# EAGLE schematic Alpha_Power_Board_v7 (EAGLE 9.6.2)

## Sheet 1 of 7
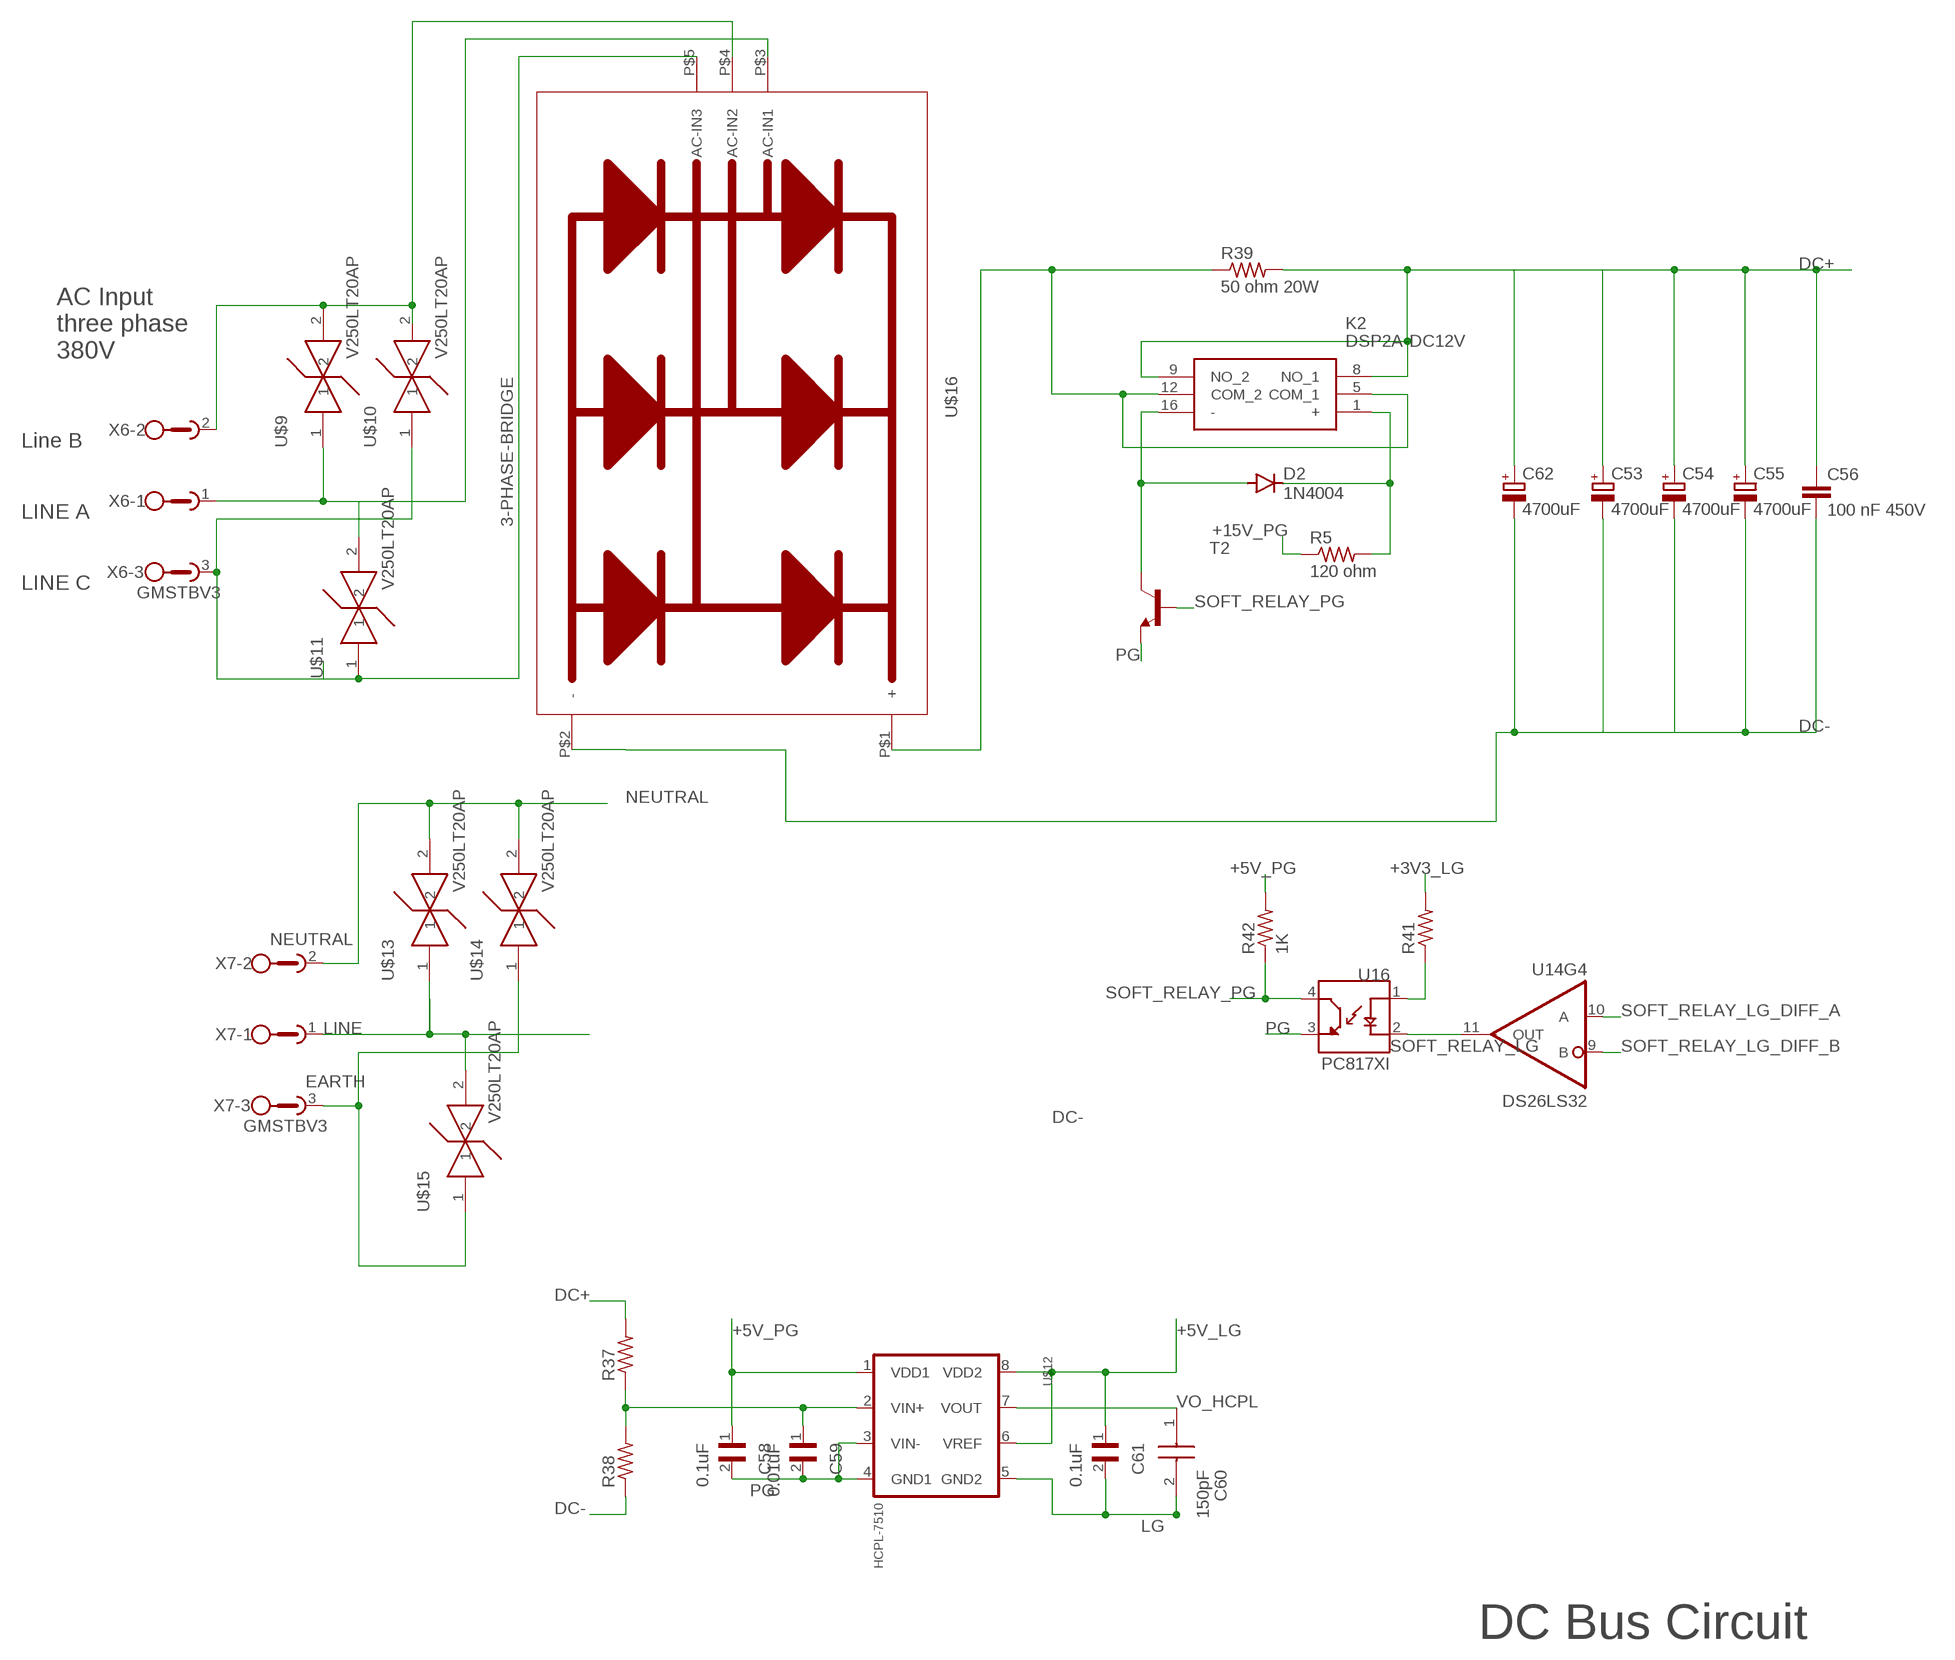
[diagram p0: schematic, sheet 1]

### Parts
C53  4700uF  CPOL-EUE10-35  [EB35D]
C54  4700uF  CPOL-EUE10-35  [EB35D]
C55  4700uF  CPOL-EUE10-35  [EB35D]
C56  100 nF 450V  C-EU102-064X133  [C102-064X133]
C58  0.1uF  C1206X104J3REC7210  [CAPC3316X140N]
C59  0.01uF  C1206X104J3REC7210  [CAPC3316X140N]
C60  150pF  CAP150PF  [CAP150PF]
C61  0.1uF  C1206X104J3REC7210  [CAPC3316X140N]
C62  4700uF  CPOL-EUE10-35  [EB35D]
D2  1N4004  [DO41-10]
K2  DSP2A-DC12V  [DSP2ADC12V]
R5  120 ohm  R-US_0207/15  [0207/15]
R37  R-US_0309/12  [0309/12]
R38  R-US_0309/12  [0309/12]
R39  50 ohm 20W  B20J50RE  [B20J50RE]
R41  R-US_R1206  [R1206]
R42  1K  R-US_R1206  [R1206]
T2  MMBT2222ALT1-NPN-SOT23-BEC  [SOT23-BEC]
U14  DS26LS32  [SOIC_16]
U16  PC817XI  [SOIC254P975X460-4N]
U$9  V250LT20AP  [V250LT20AP]
U$10  V250LT20AP  [V250LT20AP]
U$11  V250LT20AP  [V250LT20AP]
U$12  HCPL-7510  HCPL-7510U  [HCPL-7510]
U$13  V250LT20AP  [V250LT20AP]
U$14  V250LT20AP  [V250LT20AP]
U$15  V250LT20AP  [V250LT20AP]
U$16  3-PHASE-BRIDGE  [3-PHASE-BRIDGE]
X6  GMSTBV3  [GMSTBV3]
X7  GMSTBV3  [GMSTBV3]

### Nets
+3V3_LG: R41.2 ; also sheet 2,3,4,5
+5V_LG: C61.1 U$12.6(VREF) U$12.8(VDD2) ; also sheet 2,3,5
+5V_PG: C58.1 R42.2 U$12.1(VDD1) ; also sheet 2,3
+15V_PG: R5.1 ; also sheet 2,3
DC+: C53.+ C54.+ C55.+ C56.1 C62.+ K2.8(NO_1) K2.9(NO_2) R37.2 R39.2 ; also sheet 3
DC-: C53.- C54.- C55.- C56.2 C62.- R38.1 U$16.P$2(-) ; also sheet 3
EARTH: U$14.1 U$15.1 X7.3
L1: U$9.1 U$11.2 U$16.P$3(AC-IN1) X6.1
L2: U$9.2 U$10.2 U$16.P$4(AC-IN2) X6.2
L3: U$10.1 U$11.1 U$16.P$5(AC-IN3) X6.3
LG: C60.2 C61.2 U$12.5(GND2) ; also sheet 2,3,4,5,6,7
LINE: U$13.1 U$15.2 X7.1 ; also sheet 2
N$1: C59.1 R37.1 R38.2 U$12.2(VIN+)
N$2: D2.C K2.1(+) R5.2
N$3: D2.A K2.16(-) T2.C
N$4: R41.1 U16.1(A)
N$20 [New Class]: K2.5(COM_1) K2.12(COM_2) R39.1 U$16.P$1(+)
NEUTRAL: U$13.2 U$14.2 X7.2 ; also sheet 2
PG: C58.2 C59.2 T2.E U16.3(ET) U$12.3(VIN-) U$12.4(GND1) ; also sheet 2,3
SOFT_RELAY_LG: U14.11(OUT) U16.2(C)
SOFT_RELAY_LG_DIFF_A: U14.10(A) ; also sheet 7
SOFT_RELAY_LG_DIFF_B: U14.9(B) ; also sheet 7
SOFT_RELAY_PG: R42.1 T2.B U16.4(CT)
VO_HCPL: C60.1 U$12.7(VOUT) ; also sheet 4
Unconnected: U14.1(B) U14.2(A) U14.3(OUT) U14.4(EN) U14.5(OUT) U14.6(A) U14.7(B) U14.8(GND) U14.12(!EN) U14.13(OUT) U14.14(A) U14.15(B) U14.16(VCC)

### Notes on the sheet
- AC Input
  three phase 
  380V
- Line B
- LINE A
- LINE C
- DC Bus Circuit

## Sheet 2 of 7
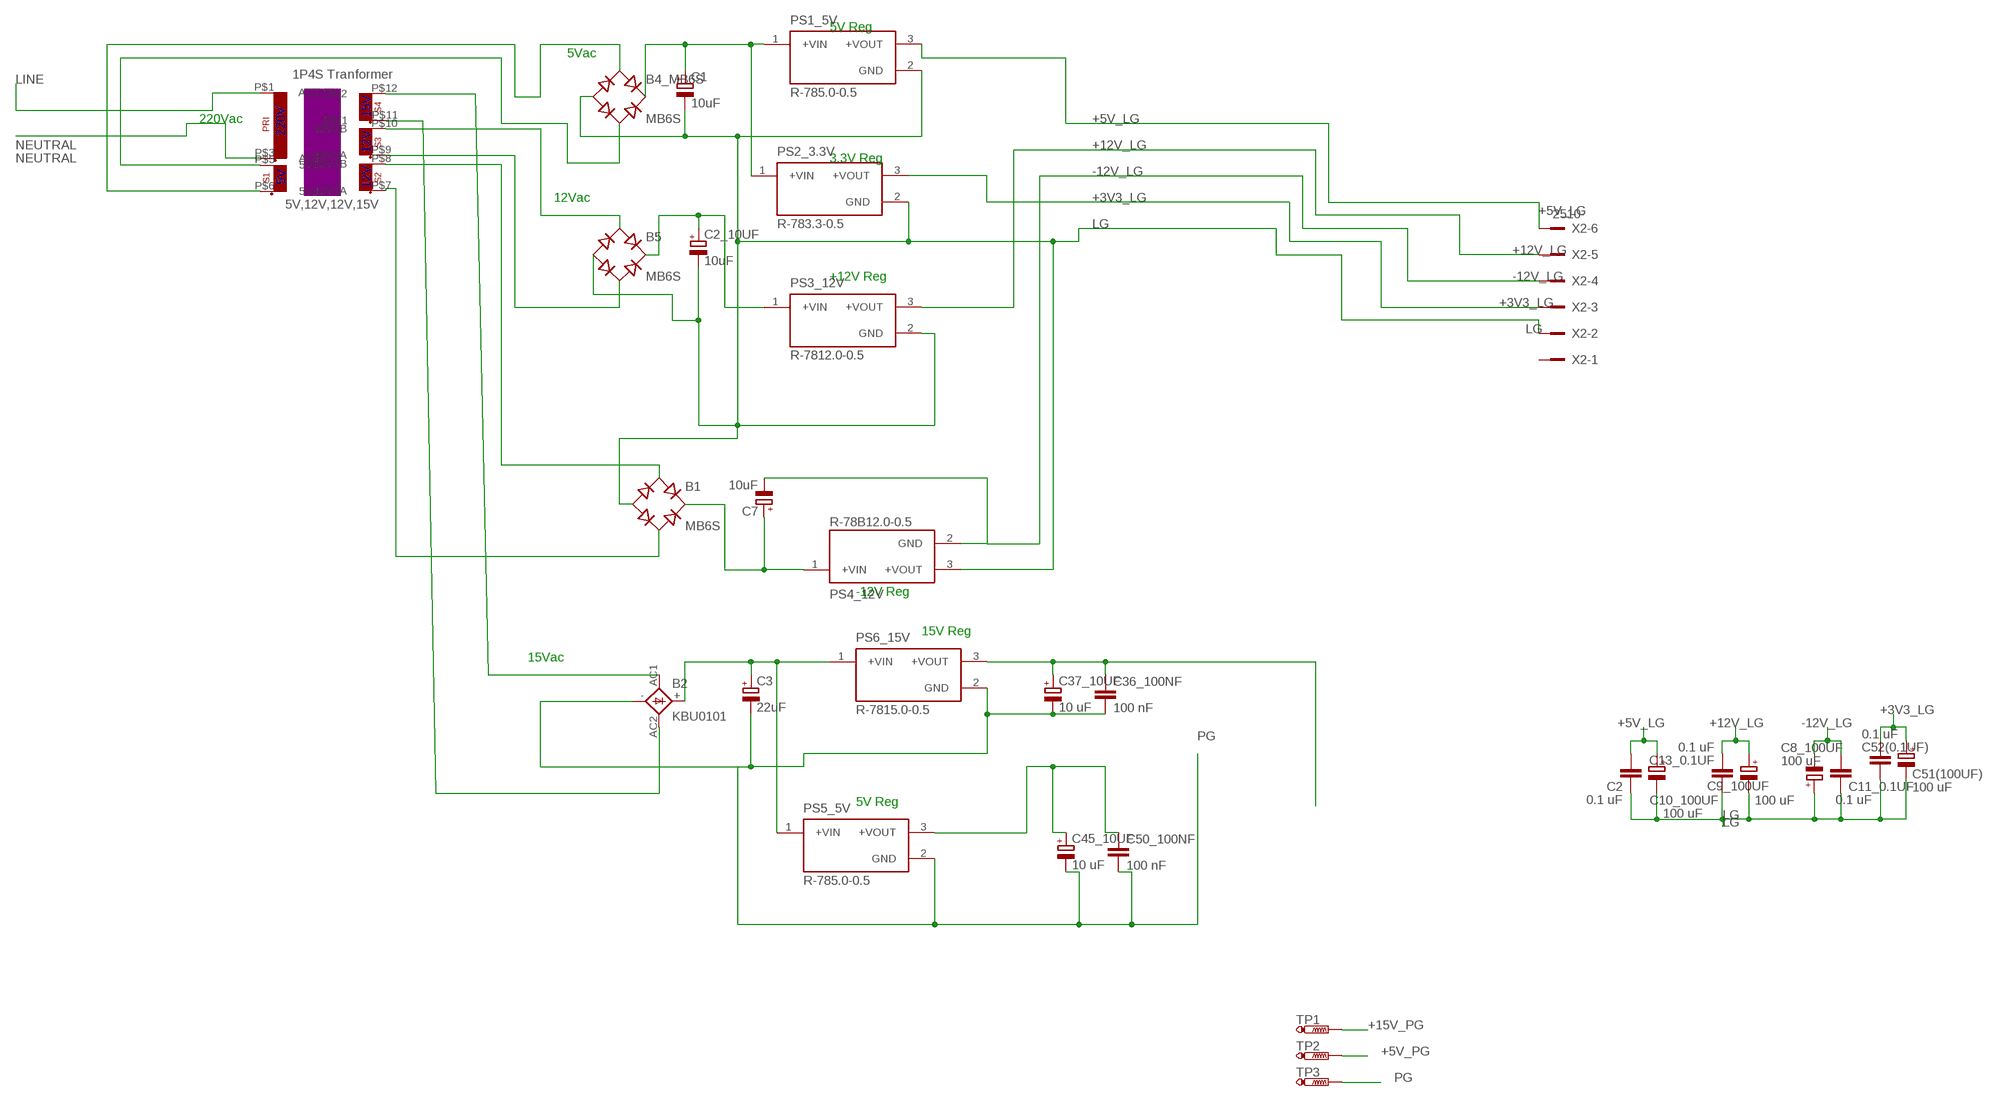
[diagram p1: schematic, sheet 2]

### Parts
B1  MB6S  [SOIC-4]
B2  KBU0101  KBU  [KBU]
B4_MB6S  MB6S  [SOIC-4]
B5  MB6S  [SOIC-4]
C1  10uF  CPOL-EUE2,5-6E  [E2,5-6E]
C2  0.1 uF  C-EUC1206  [C1206]
C2_10UF  10uF  CPOL-EUE2,5-6E  [E2,5-6E]
C3  22uF  CPOL-EUE2,5-6E  [E2,5-6E]
C7  10uF  CPOL-EUE2,5-6E  [E2,5-6E]
C8_100UF  100 uF  CPOL-EU153CLV-0605  [153CLV-0605]
C9_100UF  100 uF  CPOL-EU153CLV-0605  [153CLV-0605]
C10_100UF  100 uF  CPOL-EU153CLV-0605  [153CLV-0605]
C11_0.1UF  0.1 uF  C-EUC1206  [C1206]
C13_0.1UF  0.1 uF  C-EUC1206  [C1206]
C36_100NF  100 nF  C-EU025-025X050  [C025-025X050]
C37_10UF  10 uF  CPOL-EUTT2D5  [TT2D5]
C45_10UF  10 uF  CPOL-EUTT2D5  [TT2D5]
C50_100NF  100 nF  C-EU025-025X050  [C025-025X050]
C51(100UF)  100 uF  CPOL-EU153CLV-0605  [153CLV-0605]
C52(0.1UF)  0.1 uF  C-EUC1206  [C1206]
PS1_5V  R-785.0-0.5  R-78E5.0-0.5  [CONV_R-78E5.0-0.5]
PS2_3.3V  R-783.3-0.5  R-78E5.0-0.5  [CONV_R-78E5.0-0.5]
PS3_12V  R-7812.0-0.5  R-78E5.0-0.5  [CONV_R-78E5.0-0.5]
PS4_12V  R-78B12.0-0.5  R-78E5.0-0.5  [CONV_R-78E5.0-0.5]
PS5_5V  R-785.0-0.5  R-78E5.0-0.5  [CONV_R-78E5.0-0.5]
PS6_15V  R-7815.0-0.5  R-78E5.0-0.5  [CONV_R-78E5.0-0.5]
TP1  PTR1PAD1-13  [P1-13]
TP2  PTR1PAD1-13  [P1-13]
TP3  PTR1PAD1-13  [P1-13]
U$1  TRANSFORMERTHROUGH-HOLE  [T1P2S]
X2  2510-  [PAK100/2500-10]

### Nets
+3V3_LG: C51(100UF).+ C52(0.1UF).1 PS2_3.3V.3(+VOUT) X2.3 ; also sheet 1,3,4,5
+5V_LG: C2.1 C10_100UF.+ PS1_5V.3(+VOUT) X2.6 ; also sheet 1,3,5
+5V_PG: C45_10UF.+ C50_100NF.1 PS5_5V.3(+VOUT) TP2.TP ; also sheet 1,3
+12V_LG: C9_100UF.+ C13_0.1UF.1 PS3_12V.3(+VOUT) X2.5 ; also sheet 4,6
+15V_PG: C36_100NF.1 C37_10UF.+ PS6_15V.3(+VOUT) TP1.TP ; also sheet 1,3
-12V_LG: C7.- C8_100UF.- C11_0.1UF.1 PS4_12V.2(GND) X2.4 ; also sheet 4
LG: B1.- B4_MB6S.- B5.- C1.- C2.2 C2_10UF.- C8_100UF.+ C9_100UF.- C10_100UF.- C11_0.1UF.2 C13_0.1UF.2 C51(100UF).- C52(0.1UF).2 PS1_5V.2(GND) PS2_3.3V.2(GND) PS3_12V.2(GND) PS4_12V.3(+VOUT) X2.2 ; also sheet 1,3,4,5,6,7
LINE: U$1.P$1(AC1) ; also sheet 1
N$6: B4_MB6S.~2(AC2) U$1.P$5(5V1)
N$9: B5.~1(AC1) U$1.P$10(12V2B)
N$15: B5.~2(AC2) U$1.P$9(12V2A)
N$17: B5.+ C2_10UF.+ PS3_12V.1(+VIN)
N$18: B2.AC1 U$1.P$12(15V2)
N$19: B2.AC2 U$1.P$11(15V1)
N$24: B4_MB6S.~1(AC1) U$1.P$6(5V2)
N$25: B1.~1(AC1) U$1.P$8(12V1B)
N$26: B1.~2(AC2) U$1.P$7(12V1A)
N$27: B1.+ C7.+ PS4_12V.1(+VIN)
N$28: B2.+ C3.+ PS5_5V.1(+VIN) PS6_15V.1(+VIN)
N$29: B4_MB6S.+ C1.+ PS1_5V.1(+VIN) PS2_3.3V.1(+VIN)
NEUTRAL: U$1.P$3(AC2) ; also sheet 1
PG: B2.- C3.- C36_100NF.2 C37_10UF.- C45_10UF.- C50_100NF.2 PS5_5V.2(GND) PS6_15V.2(GND) TP3.TP ; also sheet 1,3
Unconnected: X2.1 X2.7 X2.8 X2.9 X2.10

### Notes on the sheet
- 5V Reg
- 5Vac
- 220Vac
- 3.3V Reg
- 12Vac
- +12V Reg
- -12V Reg
- 15V Reg
- 15Vac
- 5V Reg

## Sheet 3 of 7
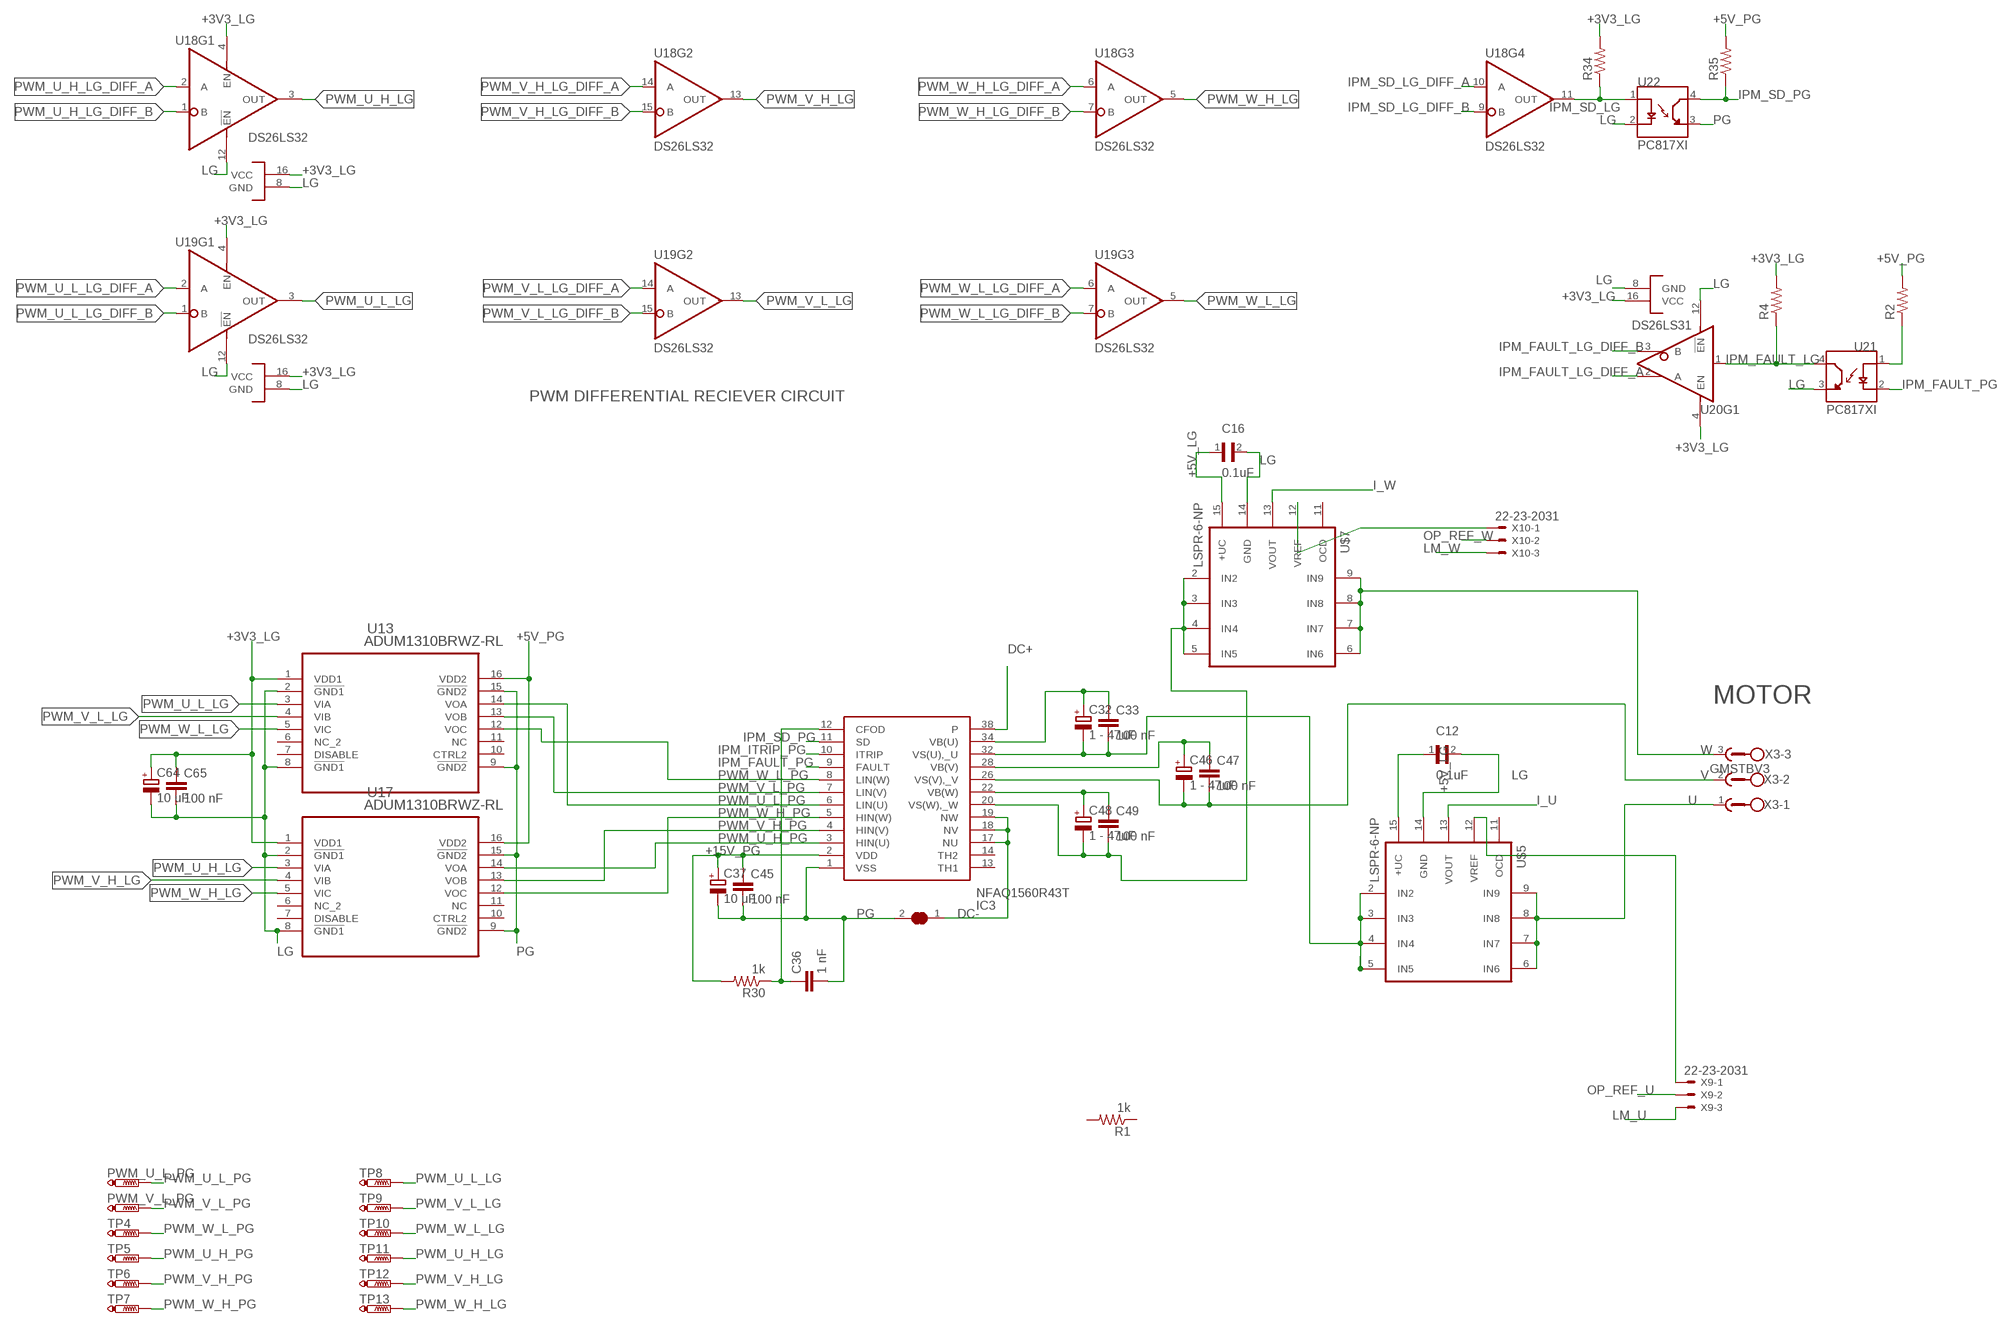
[diagram p2: schematic, sheet 3]

### Parts
C12  0.1uF  C1206X104J3REC7210  [CAPC3316X140N]
C16  0.1uF  C1206X104J3REC7210  [CAPC3316X140N]
C32  1 - 47uF  CPOL-EUE3.5-8  [E3,5-8]
C33  100 nF  C-EU025-030X050  [C025-030X050]
C36  1 nF  C-EU025-025X050  [C025-025X050]
C37  10 uF  CPOL-EUTT2D5  [TT2D5]
C45  100 nF  C-EU025-025X050  [C025-025X050]
C46  1 - 47uF  CPOL-EUE3.5-8  [E3,5-8]
C47  100 nF  C-EU025-030X050  [C025-030X050]
C48  1 - 47uF  CPOL-EUE3.5-8  [E3,5-8]
C49  100 nF  C-EU025-030X050  [C025-030X050]
C64  10 uF  CPOL-EUSMCP  [SMC_P]
C65  100 nF  C-EUC1206  [C1206]
IC3  NFAQ1560R43T  [NFAQ1560R43T]
PWM_U_L_PG  PTR1PAD1-13  [P1-13]
PWM_V_L_PG  PTR1PAD1-13  [P1-13]
R1  1k  R-US_0204/2V  [0204V]
R2  R-US_R1206  [R1206]
R4  R-US_R1206  [R1206]
R30  1k  R-US_0204/2V  [0204V]
R34  R-US_R0805W  [R0805W]
R35  R-US_R0805  [R0805]
TP4  PTR1PAD1-13  [P1-13]
TP5  PTR1PAD1-13  [P1-13]
TP6  PTR1PAD1-13  [P1-13]
TP7  PTR1PAD1-13  [P1-13]
TP8  PTR1PAD1-13  [P1-13]
TP9  PTR1PAD1-13  [P1-13]
TP10  PTR1PAD1-13  [P1-13]
TP11  PTR1PAD1-13  [P1-13]
TP12  PTR1PAD1-13  [P1-13]
TP13  PTR1PAD1-13  [P1-13]
U13  ADUM1310BRWZ-RL  [RW_16_ADI]
U17  ADUM1310BRWZ-RL  [RW_16_ADI]
U18  DS26LS32  [SOIC_16]
U19  DS26LS32  [SOIC_16]
U20  DS26LS31  [SOIC_16]
U21  PC817XI  [SOIC254P975X460-4N]
U22  PC817XI  [SOIC254P975X460-4N]
U$2  GND_CONNECT  [GND_CONNECT]
U$5  LSPR-6-NP  [LPSR-15-NP]
U$7  LSPR-6-NP  [LPSR-15-NP]
X3  GMSTBV3  [GMSTBV3]
X9  22-23-2031  [22-23-2031]
X10  22-23-2031  [22-23-2031]

### Nets
+3V3_LG: C64.+ C65.1 R4.2 R34.2 U13.1(VDD1) U17.1(VDD1) U18.4(EN) U18.16(VCC) U19.4(EN) U19.16(VCC) U20.4(EN) U20.16(VCC) ; also sheet 1,2,4,5
+5V_LG: C12.1 C16.1 U$5.15(+UC) U$7.15(+UC) ; also sheet 1,2,5
+5V_PG: R2.2 R35.2 U13.16(VDD2) U17.16(VDD2) ; also sheet 1,2
+15V_PG: C37.+ C45.1 IC3.2(VDD) R30.2 ; also sheet 1,2
DC+: IC3.38(P) ; also sheet 1
DC-: IC3.17(NU) IC3.18(NV) IC3.19(NW) U$2.1 ; also sheet 1
I_U: U$5.13(VOUT) ; also sheet 4
I_W: U$7.13(VOUT) ; also sheet 4
IPM_FAULT_LG: R4.1 U20.1(IN) U21.4(CT)
IPM_FAULT_LG_DIFF_A: U20.2(A) ; also sheet 7
IPM_FAULT_LG_DIFF_B: U20.3(B) ; also sheet 7
IPM_FAULT_PG: IC3.9(FAULT) U21.2(C)
IPM_ITRIP_PG: IC3.10(ITRIP)
IPM_SD_LG: R34.1 U18.11(OUT) U22.1(A)
IPM_SD_LG_DIFF_A: U18.10(A) ; also sheet 7
IPM_SD_LG_DIFF_B: U18.9(B) ; also sheet 7
IPM_SD_PG: IC3.11(SD) R35.1 U22.4(CT)
LG: C12.2 C16.2 C64.- C65.2 U13.2(!GND1) U13.8(!GND1) U17.2(!GND1) U17.8(!GND1) U18.8(GND) U18.12(!EN) U19.8(GND) U19.12(!EN) U20.8(GND) U20.12(!EN) U21.3(ET) U22.2(C) U$5.14(GND) U$7.14(GND) ; also sheet 1,2,4,5,6,7
LM_U: X9.3 ; also sheet 4
LM_W: X10.3 ; also sheet 4
N$14: R2.1 U21.1(A)
N$23: U$5.12(VREF) X9.1
N$30: C32.- C33.2 IC3.32(VS(U),_U) U$5.2(IN2) U$5.3(IN3) U$5.4(IN4) U$5.5(IN5)
N$33: U$7.12(VREF) X10.1
N$49: C32.+ C33.1 IC3.34(VB(U))
N$50: C48.+ C49.1 IC3.22(VB(W))
N$51: C48.- C49.2 IC3.20(VS(W),_W) U$7.2(IN2) U$7.3(IN3) U$7.4(IN4) U$7.5(IN5)
N$52: C46.+ C47.1 IC3.28(VB(V))
N$54: C36.1 IC3.12(CFOD) R30.1
OP_REF_U: X9.2 ; also sheet 4
OP_REF_W: X10.2 ; also sheet 4
PG: C36.2 C37.- C45.2 IC3.1(VSS) U13.9(!GND2) U13.15(!GND2) U17.9(!GND2) U17.15(!GND2) U22.3(ET) U$2.2 ; also sheet 1,2
PWM_U_H_LG: TP11.TP U17.3(VIA) U18.3(OUT)
PWM_U_H_LG_DIFF_A: U18.2(A) ; also sheet 7
PWM_U_H_LG_DIFF_B: U18.1(B) ; also sheet 7
PWM_U_H_PG: IC3.3(HIN(U)) TP5.TP U17.14(VOA)
PWM_U_L_LG: TP8.TP U13.3(VIA) U19.3(OUT)
PWM_U_L_LG_DIFF_A: U19.2(A) ; also sheet 7
PWM_U_L_LG_DIFF_B: U19.1(B) ; also sheet 7
PWM_U_L_PG: IC3.6(LIN(U)) PWM_U_L_PG.TP U13.14(VOA)
PWM_V_H_LG: TP12.TP U17.4(VIB) U18.13(OUT)
PWM_V_H_LG_DIFF_A: U18.14(A) ; also sheet 7
PWM_V_H_LG_DIFF_B: U18.15(B) ; also sheet 7
PWM_V_H_PG: IC3.4(HIN(V)) TP6.TP U17.13(VOB)
PWM_V_L_LG: TP9.TP U13.4(VIB) U19.13(OUT)
PWM_V_L_LG_DIFF_A: U19.14(A) ; also sheet 7
PWM_V_L_LG_DIFF_B: U19.15(B) ; also sheet 7
PWM_V_L_PG: IC3.7(LIN(V)) PWM_V_L_PG.TP U13.13(VOB)
PWM_W_H_LG: TP13.TP U17.5(VIC) U18.5(OUT)
PWM_W_H_LG_DIFF_A: U18.6(A) ; also sheet 7
PWM_W_H_LG_DIFF_B: U18.7(B) ; also sheet 7
PWM_W_H_PG: IC3.5(HIN(W)) TP7.TP U17.12(VOC)
PWM_W_L_LG: TP10.TP U13.5(VIC) U19.5(OUT)
PWM_W_L_LG_DIFF_A: U19.6(A) ; also sheet 7
PWM_W_L_LG_DIFF_B: U19.7(B) ; also sheet 7
PWM_W_L_PG: IC3.8(LIN(W)) TP4.TP U13.12(VOC)
U: U$5.6(IN6) U$5.7(IN7) U$5.8(IN8) U$5.9(IN9) X3.1
V: C46.- C47.2 IC3.26(VS(V),_V) X3.2
W: U$7.6(IN6) U$7.7(IN7) U$7.8(IN8) U$7.9(IN9) X3.3
Unconnected: IC3.13(TH1) IC3.14(TH2) R1.1 R1.2 U13.6(NC_2) U13.7(DISABLE) U13.10(CTRL2) U13.11(NC) U17.6(NC_2) U17.7(DISABLE) U17.10(CTRL2) U17.11(NC) U19.9(B) U19.10(A) U19.11(OUT) U20.5(B) U20.6(A) U20.7(IN) U20.9(IN) U20.10(A) U20.11(B) U20.13(B) U20.14(A) U20.15(IN) U$5.11(OCD) U$7.11(OCD)

### Notes on the sheet
- PWM DIFFERENTIAL RECIEVER CIRCUIT
- MOTOR

## Sheet 4 of 7
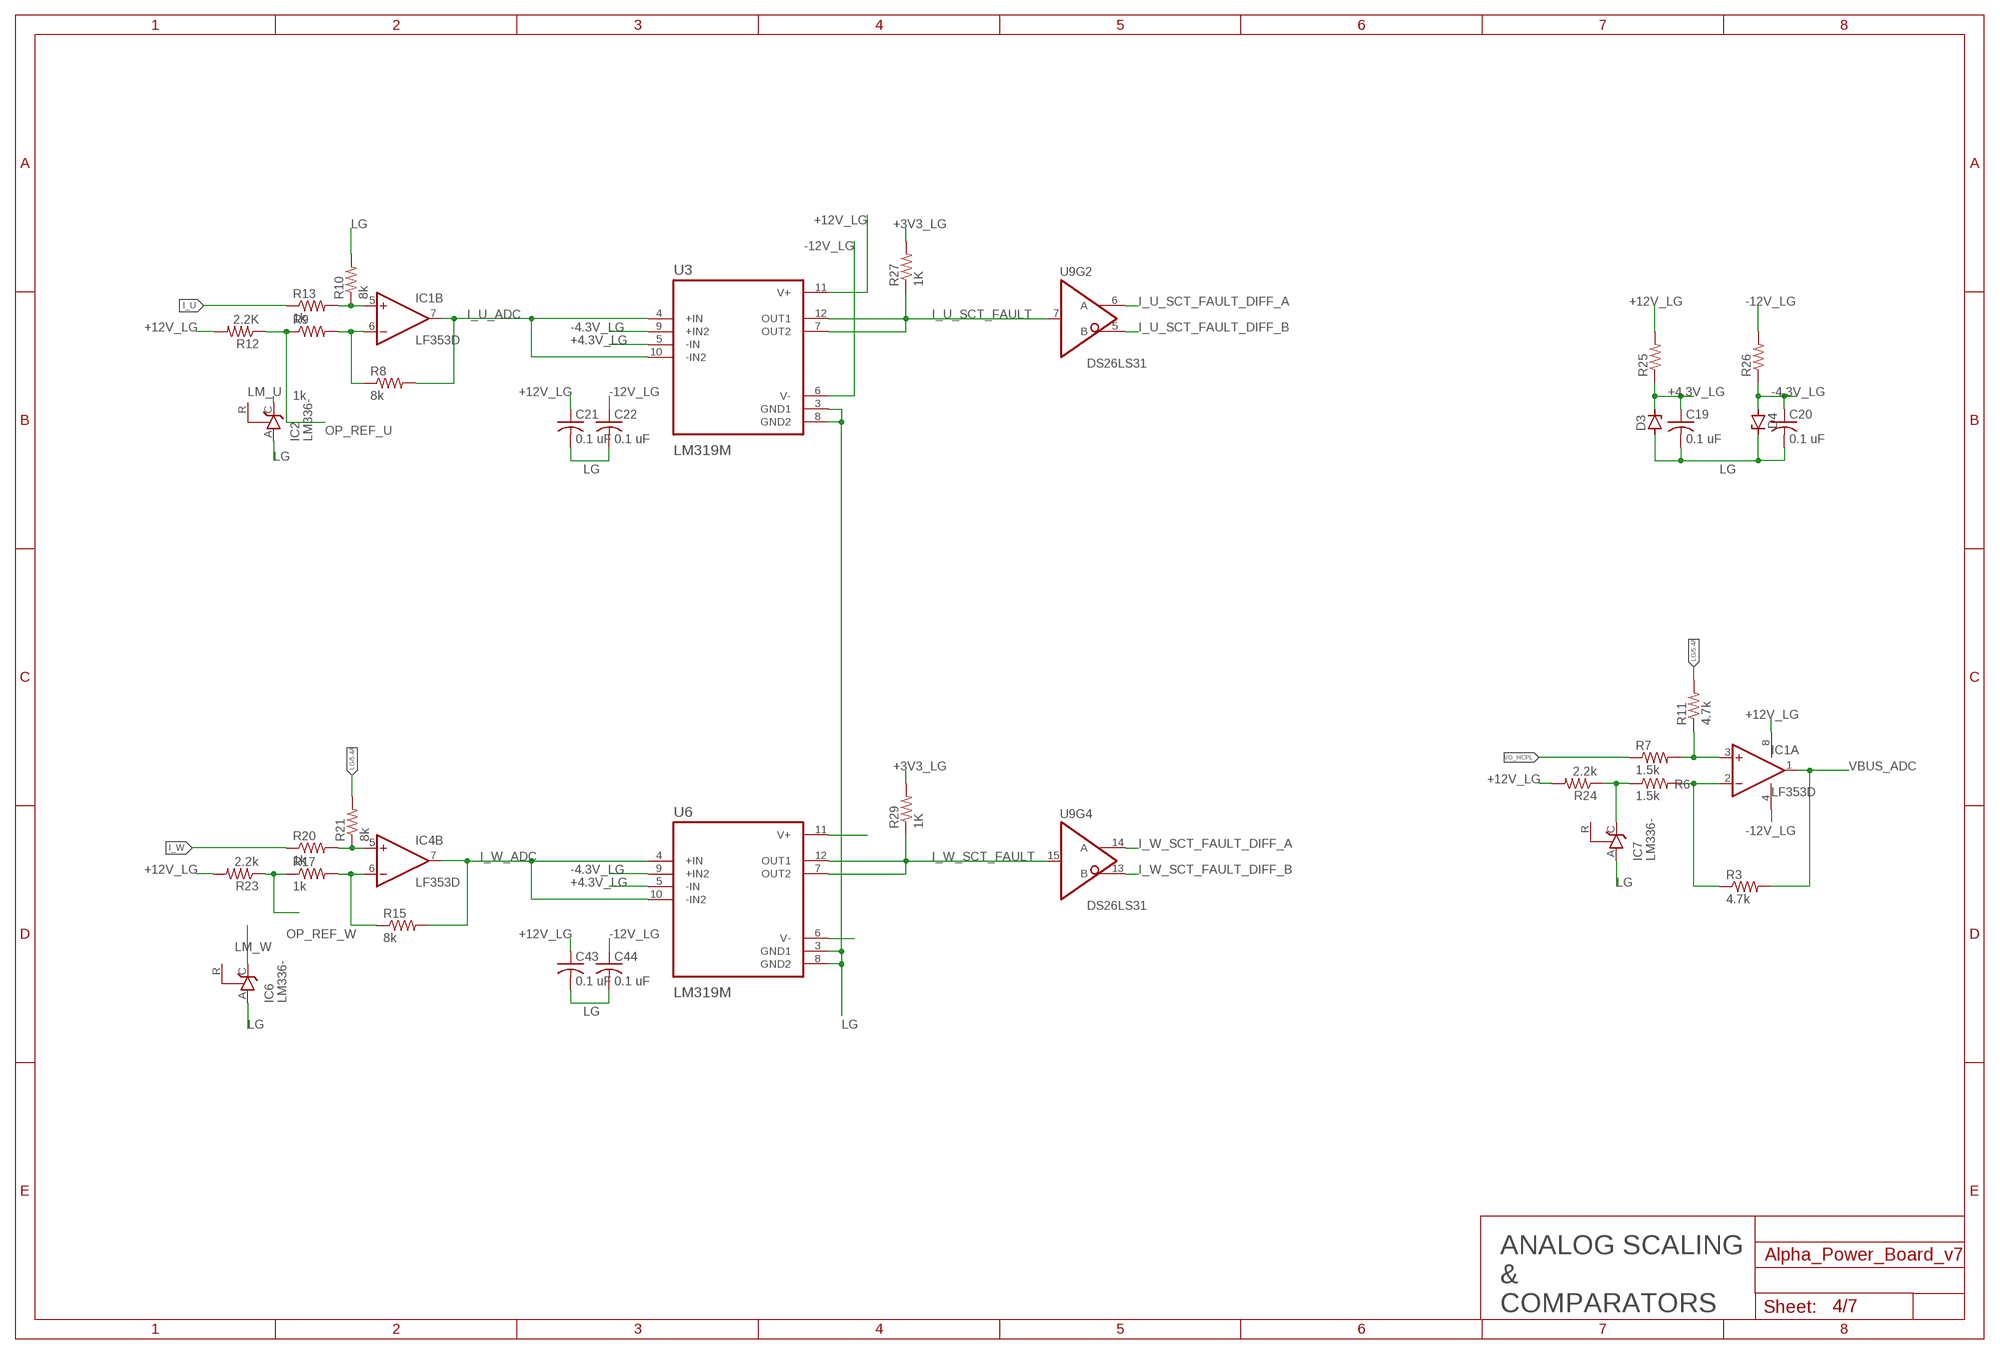
[diagram p3: schematic, sheet 4]

### Parts
C19  0.1 uF  C-USC1206  [C1206]
C20  0.1 uF  C-USC1206  [C1206]
C21  0.1 uF  C-USC1206  [C1206]
C22  0.1 uF  C-USC1206  [C1206]
C43  0.1 uF  C-USC1206  [C1206]
C44  0.1 uF  C-USC1206  [C1206]
D3  ZENER-DIODETO236  [TO236]
D4  ZENER-DIODETO236  [TO236]
IC1  LF353D  [SO08]
IC2  LM336-  [TO92A_VREF]
IC4  LF353D  [SO08]
IC6  LM336-  [TO92A_VREF]
IC7  LM336-  [TO92A_VREF]
R3  4.7k  R-US_M1206  [M1206]
R6  1.5k  R-US_M1206  [M1206]
R7  1.5k  R-US_R1206  [R1206]
R8  8k  R-US_M1206  [M1206]
R9  1k  R-US_M1206  [M1206]
R10  8k  R-US_M1206  [M1206]
R11  4.7k  R-US_M1206  [M1206]
R12  2.2K  R-US_M1206  [M1206]
R13  1k  R-US_M1206  [M1206]
R15  8k  R-US_M1206  [M1206]
R17  1k  R-US_M1206  [M1206]
R20  1k  R-US_M1206  [M1206]
R21  8k  R-US_M1206  [M1206]
R23  2.2k  R-US_M1206  [M1206]
R24  2.2k  R-US_M1206  [M1206]
R25  R-US_M1206  [M1206]
R26  R-US_M1206  [M1206]
R27  1K  R-US_R1206  [R1206]
R29  1K  R-US_R1206  [R1206]
U3  LM319M  [SOIC127P600X175-14N]
U6  LM319M  [SOIC127P600X175-14N]
U9  DS26LS31  [SOIC_16]

### Nets
+3V3_LG: R27.2 R29.2 ; also sheet 1,2,3,5
+4.3V_LG: C19.1 D3.C R25.1 U3.5(-IN) U6.5(-IN)
+12V_LG: C21.1 C43.1 IC1.8(P:V+) R12.2 R23.2 R24.2 R25.2 U3.11(V+) ; also sheet 2,6
-4.3V_LG: C20.1 D4.A R26.1 U3.9(+IN2) U6.9(+IN2)
-12V_LG: C22.1 C44.1 IC1.4(P:V-) R26.2 U3.6(V-) ; also sheet 2
I_U: R13.1 ; also sheet 3
I_U_ADC: IC1.7(B:OUT) R8.2 U3.4(+IN) U3.10(-IN2) ; also sheet 5
I_U_SCT_FAULT: R27.1 U3.7(OUT2) U3.12(OUT1) U9.7(IN)
I_U_SCT_FAULT_DIFF_A: U9.6(A) ; also sheet 7
I_U_SCT_FAULT_DIFF_B: U9.5(B) ; also sheet 7
I_W: R20.1 ; also sheet 3
I_W_ADC: IC4.7(B:OUT) R15.2 U6.4(+IN) U6.10(-IN2) ; also sheet 5
I_W_SCT_FAULT: R29.1 U6.7(OUT2) U6.12(OUT1) U9.15(IN)
I_W_SCT_FAULT_DIFF_A: U9.14(A) ; also sheet 7
I_W_SCT_FAULT_DIFF_B: U9.13(B) ; also sheet 7
LG: C19.2 C20.2 C21.2 C22.2 C43.2 C44.2 D3.A D4.C IC2.A IC6.A IC7.A R10.2 R11.2 R21.2 U3.3(GND1) U3.8(GND2) U6.3(GND1) U6.8(GND2) ; also sheet 1,2,3,5,6,7
LM_U: IC2.C ; also sheet 3
LM_W: IC6.C ; also sheet 3
N$7: IC1.6(B:-IN) R8.1 R9.2
N$8: IC1.3(A:+IN) R7.2 R11.1
N$11: IC4.6(B:-IN) R15.1 R17.2
N$12: IC1.2(A:-IN) R3.1 R6.2
N$13: U6.6(V-)
N$16: U6.11(V+)
N$34: IC1.5(B:+IN) R10.1 R13.2
N$38: IC4.5(B:+IN) R20.2 R21.1
N$43: IC7.C R6.1 R24.1
OP_REF_U: R9.1 R12.1 ; also sheet 3
OP_REF_W: R17.1 R23.1 ; also sheet 3
VBUS_ADC: IC1.1(A:OUT) R3.2 ; also sheet 5
VO_HCPL: R7.1 ; also sheet 1
Unconnected: IC2.R IC4.1(A:OUT) IC4.2(A:-IN) IC4.3(A:+IN) IC6.R IC7.R U9.1(IN) U9.2(A) U9.3(B) U9.4(EN) U9.8(GND) U9.9(IN) U9.10(A) U9.11(B) U9.12(!EN) U9.16(VCC)

### Notes on the sheet
- ANALOG SCALING
  & 
  COMPARATORS

## Sheet 5 of 7
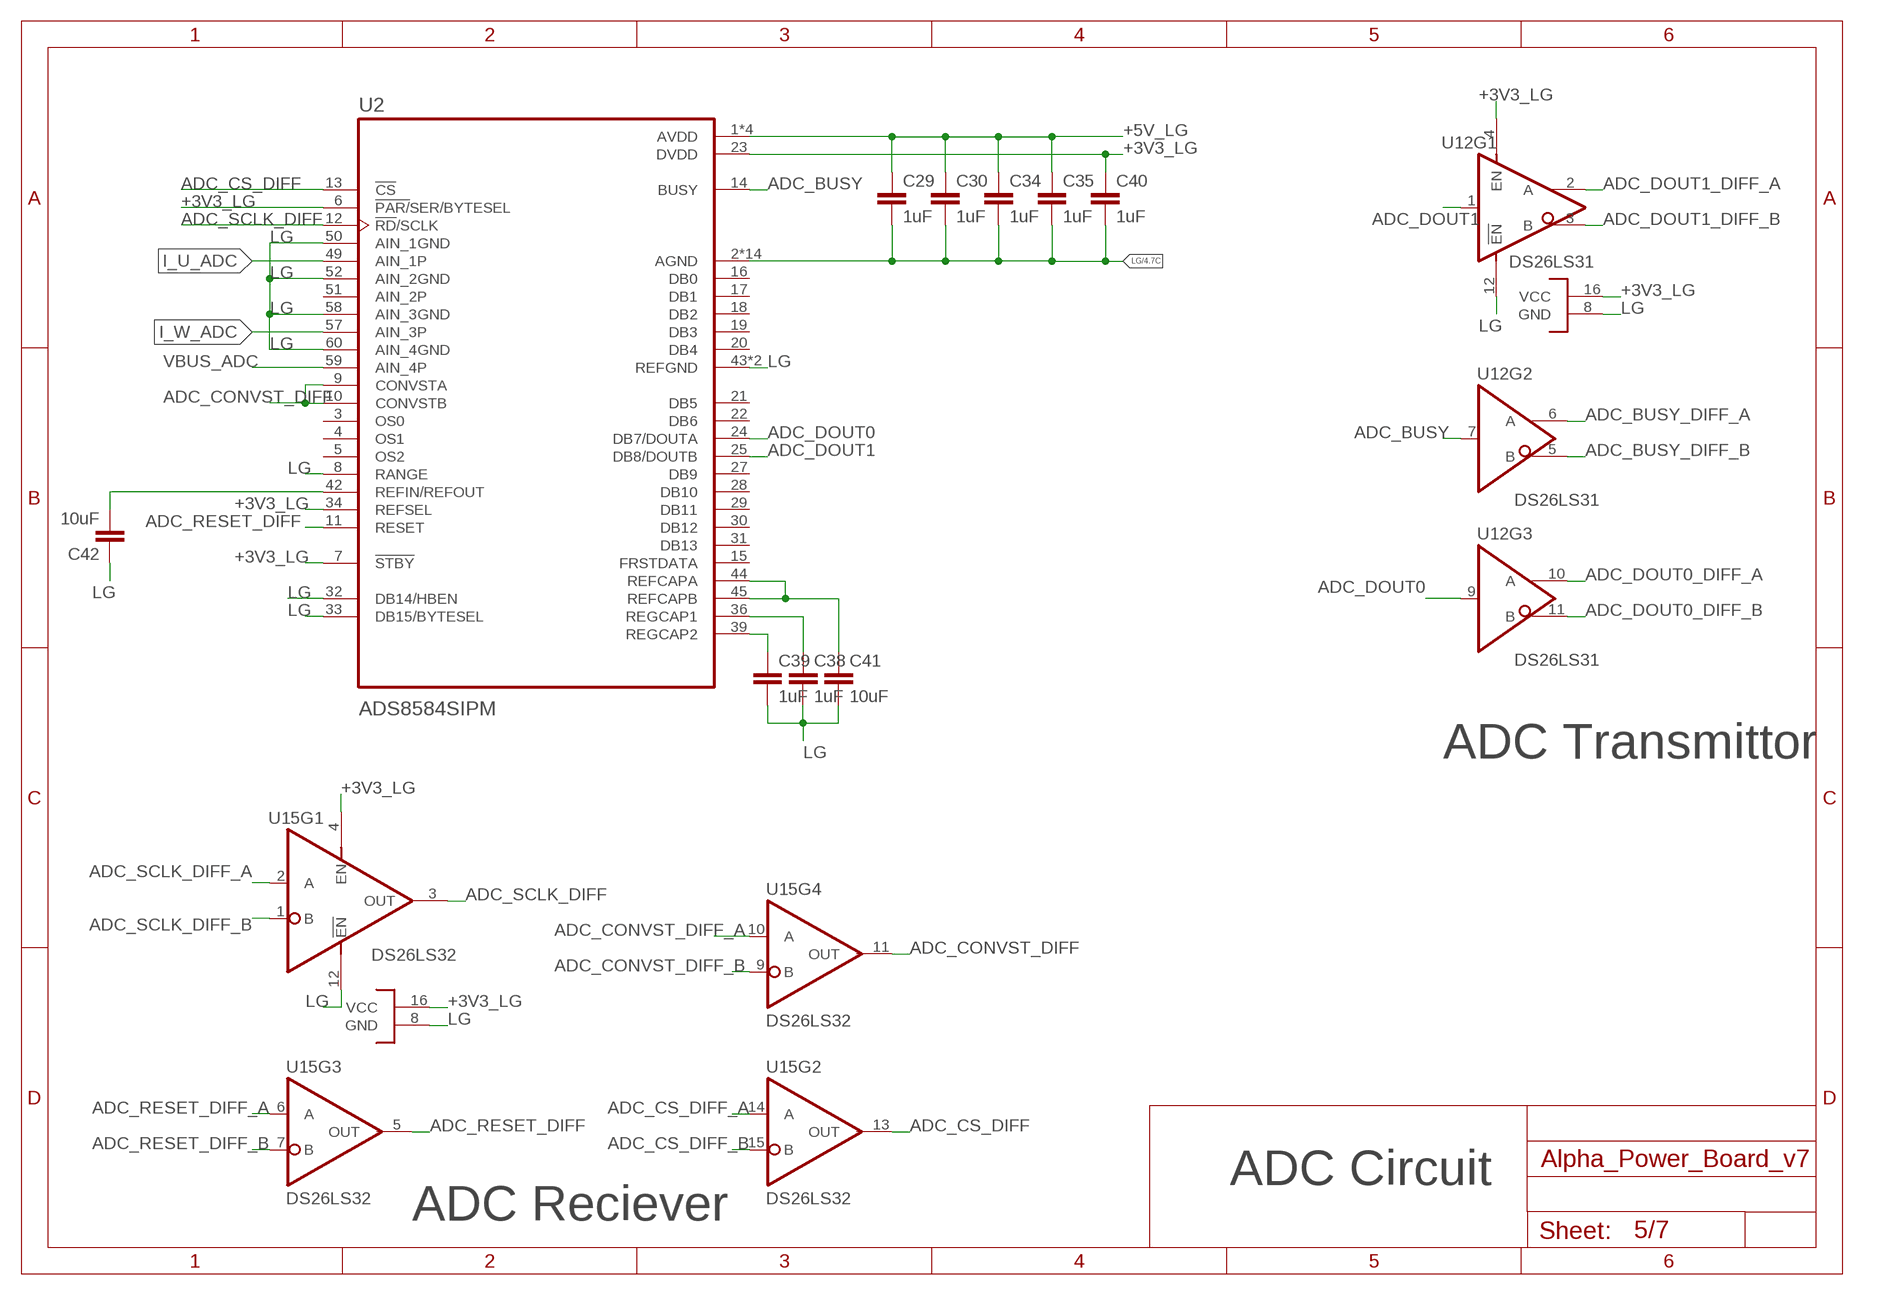
[diagram p4: schematic, sheet 5]

### Parts
C29  1uF  C-EUC0603  [C0603]
C30  1uF  C-EUC0603  [C0603]
C34  1uF  C-EUC0603  [C0603]
C35  1uF  C-EUC0603  [C0603]
C38  1uF  C-EUC0603  [C0603]
C39  1uF  C-EUC0603  [C0603]
C40  1uF  C-EUC0603  [C0603]
C41  10uF  C-EUC0603  [C0603]
C42  10uF  C-EUC0603  [C0603]
U2  ADS8584SIPM  [QFP50P1200X1200X160-64N]
U12  DS26LS31  [SOIC_16]
U15  DS26LS32  [SOIC_16]

### Nets
+3V3_LG: C40.1 U2.6(!PAR/!SER/BYTESEL) U2.7(!STBY) U2.23(DVDD) U2.34(REFSEL) U12.4(EN) U12.16(VCC) U15.4(EN) U15.16(VCC) ; also sheet 1,2,3,4
+5V_LG: C29.1 C30.1 C34.1 C35.1 U2.1(AVDD) U2.37(AVDD) U2.38(AVDD) U2.48(AVDD) ; also sheet 1,2,3
ADC_BUSY: U2.14(BUSY) U12.7(IN)
ADC_BUSY_DIFF_A: U12.6(A) ; also sheet 7
ADC_BUSY_DIFF_B: U12.5(B) ; also sheet 7
ADC_CONVST_DIFF: U2.9(CONVSTA) U2.10(CONVSTB) U15.11(OUT)
ADC_CONVST_DIFF_A: U15.10(A) ; also sheet 7
ADC_CONVST_DIFF_B: U15.9(B) ; also sheet 7
ADC_CS_DIFF: U2.13(!CS) U15.13(OUT)
ADC_CS_DIFF_A: U15.14(A) ; also sheet 7
ADC_CS_DIFF_B: U15.15(B) ; also sheet 7
ADC_DOUT0: U2.24(DB7/DOUTA) U12.9(IN)
ADC_DOUT0_DIFF_A: U12.10(A) ; also sheet 7
ADC_DOUT0_DIFF_B: U12.11(B) ; also sheet 7
ADC_DOUT1: U2.25(DB8/DOUTB) U12.1(IN)
ADC_DOUT1_DIFF_A: U12.2(A) ; also sheet 7
ADC_DOUT1_DIFF_B: U12.3(B) ; also sheet 7
ADC_RESET_DIFF: U2.11(RESET) U15.5(OUT)
ADC_RESET_DIFF_A: U15.6(A) ; also sheet 7
ADC_RESET_DIFF_B: U15.7(B) ; also sheet 7
ADC_SCLK_DIFF: U2.12(!RD!/SCLK) U15.3(OUT)
ADC_SCLK_DIFF_A: U15.2(A) ; also sheet 7
ADC_SCLK_DIFF_B: U15.1(B) ; also sheet 7
I_U_ADC: U2.49(AIN_1P) ; also sheet 4
I_W_ADC: U2.57(AIN_3P) ; also sheet 4
LG: C29.2 C30.2 C34.2 C35.2 C38.2 C39.2 C40.2 C41.2 C42.1 U2.2(AGND) U2.8(RANGE) U2.26(AGND) U2.32(DB14/HBEN) U2.33(DB15/BYTESEL) U2.35(AGND) U2.40(AGND) U2.41(AGND) U2.43(REFGND) U2.46(REFGND) U2.47(AGND) U2.50(AIN_1GND) U2.52(AIN_2GND) U2.53(AGND) U2.54(AGND) U2.55(AGND) U2.56(AGND) U2.58(AIN_3GND) U2.60(AIN_4GND) U2.61(AGND) U2.62(AGND) U2.63(AGND) U2.64(AGND) U12.8(GND) U12.12(!EN) U15.8(GND) U15.12(!EN) ; also sheet 1,2,3,4,6,7
N$37: C39.1 U2.39(REGCAP2)
N$39: C42.2 U2.42(REFIN/REFOUT)
N$44: C38.1 U2.36(REGCAP1)
N$46: C41.1 U2.44(REFCAPA) U2.45(REFCAPB)
VBUS_ADC: U2.59(AIN_4P) ; also sheet 4
Unconnected: U2.3(OS0) U2.4(OS1) U2.5(OS2) U2.15(FRSTDATA) U2.16(DB0) U2.17(DB1) U2.18(DB2) U2.19(DB3) U2.20(DB4) U2.21(DB5) U2.22(DB6) U2.27(DB9) U2.28(DB10) U2.29(DB11) U2.30(DB12) U2.31(DB13) U2.51(AIN_2P) U12.13(B) U12.14(A) U12.15(IN)

### Notes on the sheet
- ADC Transmittor
- ADC Circuit
- ADC Reciever

## Sheet 6 of 7
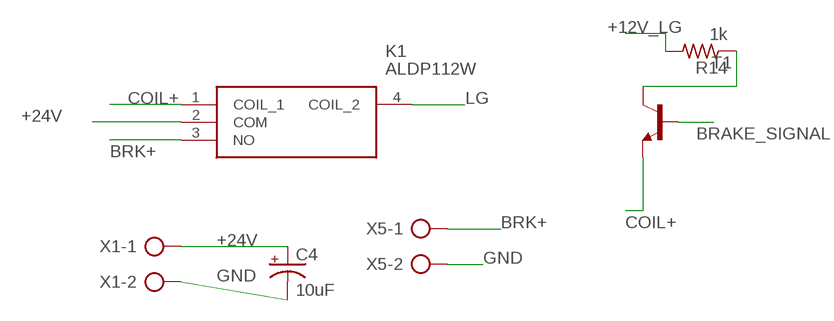
[diagram p5: schematic, sheet 6]

### Parts
C4  10uF  CPOL-USE2,5-6E  [E2,5-6E]
K1  ALDP112W  [ALDP112W]
R14  1k  R-US_0204/2V  [0204V]
T1  MMBT2222ALT1-NPN-SOT23-BEC  [SOT23-BEC]
X1  AK500/2-H  [AK500/2-H]
X5  AK500/2-H  [AK500/2-H]

### Nets
+12V_LG: R14.2 ; also sheet 2,4
+24V: C4.+ K1.2(COM) X1.1
BRAKE_SIGNAL: T1.B
BRK+: K1.3(NO) X5.1
COIL+: K1.1(COIL_1) T1.E
GND: C4.- X1.2 X5.2
LG: K1.4(COIL_2) ; also sheet 1,2,3,4,5,7
N$5: R14.1 T1.C

## Sheet 7 of 7
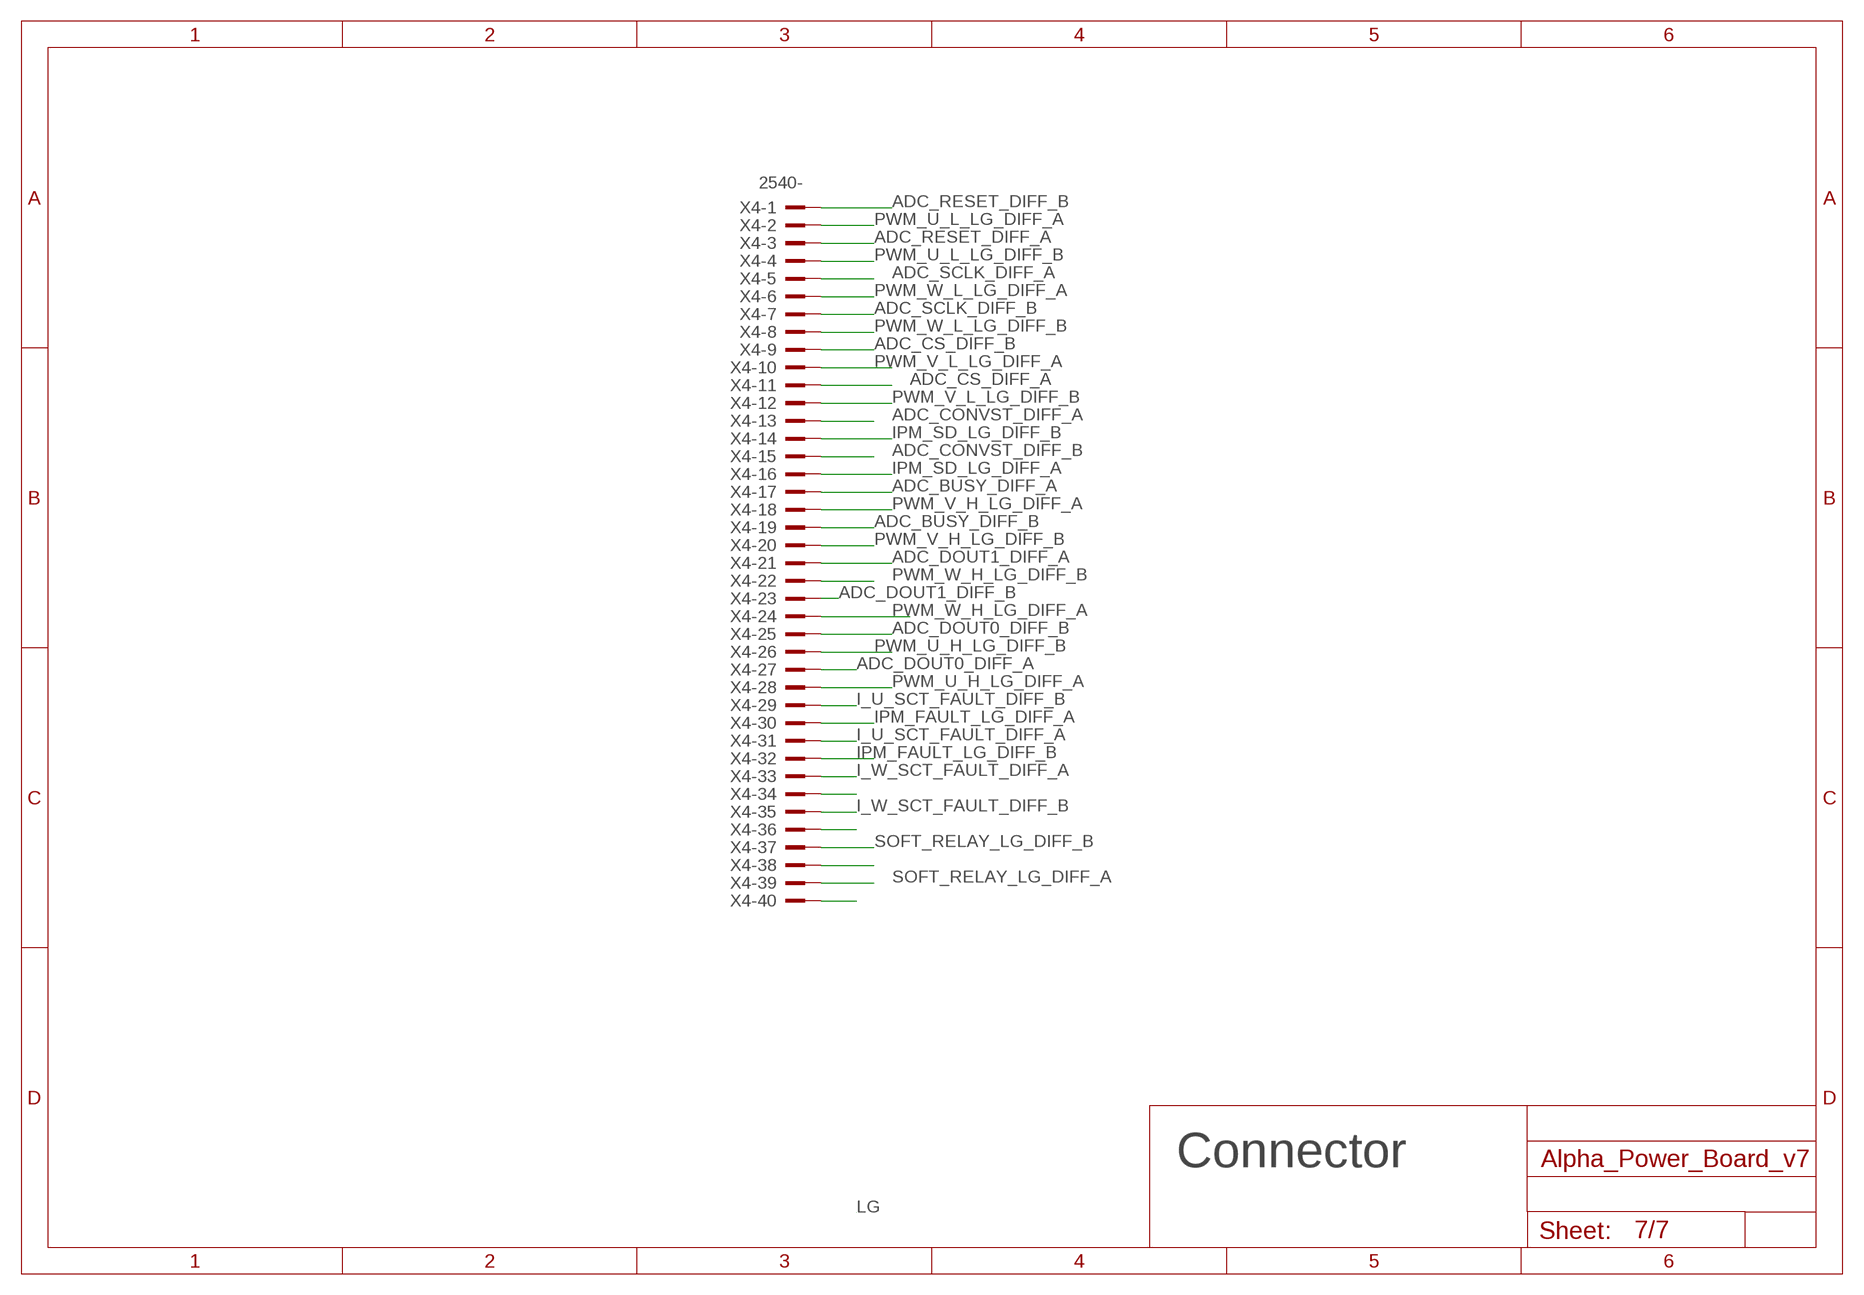
[diagram p6: schematic, sheet 7]

### Parts
X4  2540-  [PAK100/2500-40]

### Nets
ADC_BUSY_DIFF_A: X4.17 ; also sheet 5
ADC_BUSY_DIFF_B: X4.19 ; also sheet 5
ADC_CONVST_DIFF_A: X4.13 ; also sheet 5
ADC_CONVST_DIFF_B: X4.15 ; also sheet 5
ADC_CS_DIFF_A: X4.11 ; also sheet 5
ADC_CS_DIFF_B: X4.9 ; also sheet 5
ADC_DOUT0_DIFF_A: X4.27 ; also sheet 5
ADC_DOUT0_DIFF_B: X4.25 ; also sheet 5
ADC_DOUT1_DIFF_A: X4.21 ; also sheet 5
ADC_DOUT1_DIFF_B: X4.23 ; also sheet 5
ADC_RESET_DIFF_A: X4.3 ; also sheet 5
ADC_RESET_DIFF_B: X4.1 ; also sheet 5
ADC_SCLK_DIFF_A: X4.5 ; also sheet 5
ADC_SCLK_DIFF_B: X4.7 ; also sheet 5
I_U_SCT_FAULT_DIFF_A: X4.31 ; also sheet 4
I_U_SCT_FAULT_DIFF_B: X4.29 ; also sheet 4
I_W_SCT_FAULT_DIFF_A: X4.33 ; also sheet 4
I_W_SCT_FAULT_DIFF_B: X4.34 X4.35 ; also sheet 4
IPM_FAULT_LG_DIFF_A: X4.30 ; also sheet 3
IPM_FAULT_LG_DIFF_B: X4.32 ; also sheet 3
IPM_SD_LG_DIFF_A: X4.16 ; also sheet 3
IPM_SD_LG_DIFF_B: X4.14 ; also sheet 3
N$21: X4.36
N$63: X4.38
N$65: X4.40
PWM_U_H_LG_DIFF_A: X4.28 ; also sheet 3
PWM_U_H_LG_DIFF_B: X4.26 ; also sheet 3
PWM_U_L_LG_DIFF_A: X4.2 ; also sheet 3
PWM_U_L_LG_DIFF_B: X4.4 ; also sheet 3
PWM_V_H_LG_DIFF_A: X4.18 ; also sheet 3
PWM_V_H_LG_DIFF_B: X4.20 ; also sheet 3
PWM_V_L_LG_DIFF_A: X4.10 ; also sheet 3
PWM_V_L_LG_DIFF_B: X4.12 ; also sheet 3
PWM_W_H_LG_DIFF_A: X4.24 ; also sheet 3
PWM_W_H_LG_DIFF_B: X4.22 ; also sheet 3
PWM_W_L_LG_DIFF_A: X4.6 ; also sheet 3
PWM_W_L_LG_DIFF_B: X4.8 ; also sheet 3
SOFT_RELAY_LG_DIFF_A: X4.39 ; also sheet 1
SOFT_RELAY_LG_DIFF_B: X4.37 ; also sheet 1

### Notes on the sheet
- Connector

## Power pins joined to a net without a drawn wire
V+: IC4.8(P:V+)
V-: IC4.4(P:V-)

## Library data of the parts
B1 B4_MB6S B5 = rectifier:MB*S: Bridge Rectifier Source: http://www.fairchildsemi.com/ds/MB/MB6S.pdf
B2 = rectifier:KBU: DIOTEC RECTIFIER
C1 C2_10UF C3 C7 = rcl:CPOL-EU: POLARIZED CAPACITOR, European symbol; SPICEPREFIX: C
C2 C13_0.1UF C33 C36 C36_100NF C45 C47 C49 C50_100NF C52(0.1UF) C56 C65 = rcl:C-EU: CAPACITOR, European symbol
C4 = rcl:CPOL-US: POLARIZED CAPACITOR, American symbol; SPICEPREFIX: C
C8_100UF C9_100UF C10_100UF C32 C37 C37_10UF C45_10UF C46 C48 C51(100UF) C64 = rcl:CPOL-EU: POLARIZED CAPACITOR, European symbol
C11_0.1UF = rcl:C-EU: CAPACITOR, European symbol; SPICEPREFIX: C
C12 C16 C58 C59 C61 = C1206X104J3REC7210:C1206X104J3REC7210: Check prices <https://pricing.snapeda.com/parts/C1206X104J3REC7210/KEMET/view-part?ref=eda>; AVAILABILITY: Not in stock; DESCRIPTION: Multilayer Ceramic Capacitors MLCC - SMD/SMT 25V 0.1uF X7R 1206 5%; MF: KEMET; MP: C1206X104J3REC7210; PACKAGE: 3316 KEMET; PRICE: None
C19-C22 C43 C44 = rcl@2:C-US: CAPACITOR, American symbol; SPICEPREFIX: C
C29 C30 C34 C35 C38-C42 = rcl@1:C-EU: CAPACITOR, European symbol; SPICEPREFIX: C
C53-C55 C62 = resistor:CPOL-EU: POLARIZED CAPACITOR, European symbol
C60 = Cap150pf:CAP150PF: Capacitor GCM31 L=3.2mm W=1.6mm T=1.0mm Source: Datasheet <https://psearch.en.murata.com/capacitor/product/GCM31A7U2J151JX01#.html>; DESCRIPTION: Capacitor GCM31 L=3.2mm W=1.6mm T=1.0mm; HEIGHT: 1mm; MANUFACTURER_NAME: Murata Electronics; MANUFACTURER_PART_NUMBER: GCM31A7U2J151JX01D; MOUSER_PART_NUMBER: 81-GCM31A7U2J151JX1D; MOUSER_PRICE-STOCK: https://www.mouser.com/Search/Refine.aspx?Keyword=81-GCM31A7U2J151JX1D
D2 = diode:1N4004: DIODE general purpose rectifier, 1 A
D3 = diode@1:ZENER-DIODE: Z-Diode
D4 = diode@1:ZENER-DIODE: Z-Diode; SPICEPREFIX: D
IC1 IC4 = LF353:LF353: OP AMP Check prices <https://pricing.snapeda.com/parts/LF353/ON%20Semiconductor/view-part?ref=eda>; AVAILABILITY: In Stock; DESCRIPTION: J-FET Amplifier 2 Circuit 8-SOIC; MF: ON Semiconductor; MP: LF353; PACKAGE: SO-8 ON Semiconductor; PRICE: None; PURCHASE-URL: https://pricing.snapeda.com/search/part/LF353/?ref=eda
IC2 IC6 IC7 = oldchips2:LM336: Voltage reference
IC3 = NFAQ1560R43T_Fixed:NFAQ1560R43T: Motor / Motion / Ignition Controllers & Drivers DIPS6 V3 RC 600V/15A LONG LEAD Source: Datasheet <https://www.onsemi.cn/pdf/datasheet/nfaq1560r43t-d.pdf>; DESCRIPTION: Motor / Motion / Ignition Controllers & Drivers DIPS6 V3 RC 600V/15A LONG LEAD; HEIGHT: 4.6mm; MANUFACTURER_NAME: ON Semiconductor; MANUFACTURER_PART_NUMBER: NFAQ1560R43T
K1 = ALDP112W:ALDP112W: General Purpose Relays LD-P Relay Source: Datasheet <https://industrial.panasonic.com/ac/cdn/e/control/relay/power/catalog/mech_eng_ldp.pdf>; ARROW_PART_NUMBER: ALDP112W; ARROW_PRICE-STOCK: https://www.arrow.com/en/products/aldp112w/panasonic?region=europe; DESCRIPTION: General Purpose Relays LD-P Relay; HEIGHT: 15.6mm; MANUFACTURER_NAME: Panasonic; MANUFACTURER_PART_NUMBER: ALDP112W; MOUSER_PART_NUMBER: 769-ALDP112W; MOUSER_PRICE-STOCK: https://www.mouser.co.uk/ProductDetail/Panasonic-Industrial-Devices/ALDP112W?qs=ULPeSRWjSCLO7I33wztnIA%3D%3D
K2 = DSP2A-DC12V:DSP2A-DC12V: General Purpose Relays 5A 12VDC DPST NO SEALED Source: Datasheet <https://www3.panasonic.biz/ac/cdn/e/control/relay/power/catalog/mech_eng_dsp.pdf>; ARROW_PART_NUMBER: DSP2A-DC12V; ARROW_PRICE-STOCK: https://www.arrow.com/en/products/dsp2a-dc12v/panasonic?region=nac; DESCRIPTION: General Purpose Relays 5A 12VDC DPST NO SEALED; HEIGHT: 10.5mm; MANUFACTURER_NAME: Panasonic; MANUFACTURER_PART_NUMBER: DSP2A-DC12V; MOUSER_PART_NUMBER: 769-DSP2A-DC12V; MOUSER_PRICE-STOCK: https://www.mouser.co.uk/ProductDetail/Panasonic-Industrial-Devices/DSP2A-DC12V?qs=HLLy2pIPwusfp2R8jqCZIg%3D%3D
PS1_5V PS2_3.3V PS3_12V PS4_12V PS5_5V PS6_15V = R-78E5.0-0.5:R-78E5.0-0.5: 0.5 Amp SIP3 Single Output Check availability <https://pricing.snapeda.com/parts/R-78E5.0-0.5/Recom%20Power/view-part?ref=eda>; AVAILABILITY: In Stock; CHECK_PRICES: https://www.snapeda.com/parts/R-78E5.0-0.5/Recom+Power/view-part/?ref=eda; DESCRIPTION: DC/DC Converter; 0.5A 5V OUT SIP VERT | RECOM Power Inc. R-78E5.0-0.5; MF: Recom Power; MP: R-78E5.0-0.5; PACKAGE: SIP-3 Recom Power; PRICE: None; PURCHASE-URL: https://www.snapeda.com/api/url_track_click_mouser/?unipart_id=229067&manufacturer=Recom Power&part_name=R-78E5.0-0.5&search_term=None; SNAPEDA_LINK: https://www.snapeda.com/parts/R-78E5.0-0.5/Recom+Power/view-part/?ref=snap
PWM_U_L_PG PWM_V_L_PG TP1-TP13 = testpad:PTR1: TEST PIN
R1 R14 R30 = rcl:R-US_: RESISTOR, American symbol
R2 R4 R25-R27 R29 R34 R35 R41 R42 = rcl@2:R-US_: RESISTOR, American symbol; SPICEPREFIX: R
R3 R6-R13 R15 R17 R20 R21 R23 R24 = adafruit:R-US_: RESISTOR, American symbol
R5 R37 R38 = rcl:R-US_: RESISTOR, American symbol; SPICEPREFIX: R
R39 = PowerResistor:B20J50RE
T1 T2 = transistor:*-NPN-: NPN Transistror BF959 corrected 2008.03.06
U2 = ADS8584SIPM:ADS8584SIPM: Check prices <https://pricing.snapeda.com/parts/ADS8584SIPM/Texas%20Instruments/view-part?ref=eda>; AVAILABILITY: In Stock; DESCRIPTION: 16-Bit High-Speed 4-Channel Simultaneous-Sampling ADC With Bipolar Inputs on a Single Supply 64-LQFP -40 to 125; MF: Texas Instruments; MP: ADS8584SIPM; PACKAGE: LQFP-64 Texas Instruments; PRICE: None; PURCHASE-URL: https://pricing.snapeda.com/search/part/ADS8584SIPM/?ref=eda
U3 U6 = LM319M:LM319M: Check availability <https://pricing.snapeda.com/parts/LM319M/Texas%20Instruments/view-part?ref=eda>; AVAILABILITY: In Stock; DESCRIPTION: Dual high speed, high voltage comparator; MF: Texas Instruments; MP: LM319M; PACKAGE: SOIC-14 Texas Instruments; PRICE: None; PURCHASE-URL: https://pricing.snapeda.com/search/part/LM319M/?ref=eda
U9 U12 U20 = Differential_Drivers_Receivers:DS26LS31
U13 U17 = ADUM1310BRWZ:ADUM1310BRWZ-RL; BUILT_BY: EMA_UL_Team; COPYRIGHT: Copyright (C) 2018 Accelerated Designs. All rights reserved; MANUFACTURER_PART_NUMBER: ADUM1310BRWZ-RL; SOURCELIBRARY: Analog_2019-03-08; VENDOR: Analog Devices Inc
U14 U15 U18 U19 = Differential_Drivers_Receivers:DS26LS32
U16 U21 U22 = PC817XI:PC817XI: Semiconductors and Actives, Optocouplers/Optoisolators, trans, Optoelectronics, smd Check availability <https://pricing.snapeda.com/parts/PC817XI/Sharp%20Microelectronics/view-part?ref=eda>; AVAILABILITY: In Stock; DESCRIPTION: Optoisolator Transistor Output 5000Vrms 1 Channel 4-SMD; MF: Sharp Microelectronics; MP: PC817XI; PACKAGE: SMD-4 Sharp Microelectronics; PRICE: None; PURCHASE-URL: https://pricing.snapeda.com/search/part/PC817XI/?ref=eda
U$1 = Transformer:TRANSFORMER
U$2 = GND_CONNECT:GND_CONNECT
U$5 U$7 = LSPR-15-NP:LSPR-6-NP
U$9-U$11 U$13-U$15 = V250LT20AP:V250LT20AP: Varistor Check prices <https://pricing.snapeda.com/parts/V18ZA2P/Littelfuse%20Inc./view-part?ref=eda>; AVAILABILITY: In Stock; DESCRIPTION: 18V 500A Varistor 1 Circuit Through Hole Disc 10mm; MF: Littelfuse Inc.; MP: V18ZA2P; PACKAGE: Disc-10 Littelfuse; PRICE: None
U$12 = HCPL-7510:HCPL-7510
U$16 = 3-phase-bridge:3-PHASE-BRIDGE: DB25-08
X1 X5 = con-ptr500:AK500/2-H: CONNECTOR Aug. 2004 / PTR Meßtechnik: Die Bezeichnung der Serie AK505 wurde geändert. Es handelt sich hierbei um AK500 in horizontaler Ausführung.; OC_FARNELL: unknown; OC_NEWARK: unknown
X2 = con-3m:2510-: 3M (TM) Pak 100 4-Wall Header Source: 3M; MF: 3M; MPN: 2510-6002UB; OC_FARNELL: 9838244; OC_NEWARK: 46F4725
X3 X6 X7 = con-phoenix-762:GMSTBV3: PHOENIX; MPN: GMSTBVA2,5/3-G-7,62; OC_FARNELL: 1793080; OC_NEWARK: 69R9521
X4 = con-3m:2540-: 3M (TM) Pak 100 4-Wall Header Source: 3M; OC_FARNELL: unknown; OC_NEWARK: unknown
X9 X10 = con-molex:22-23-2031: .100" (2.54mm) Center Header - 3 Pin; MF: MOLEX; MPN: 22-23-2031; OC_FARNELL: 1462950; OC_NEWARK: 30C0862